# Altium schematic sheet SD_SC.SchDoc
size A4
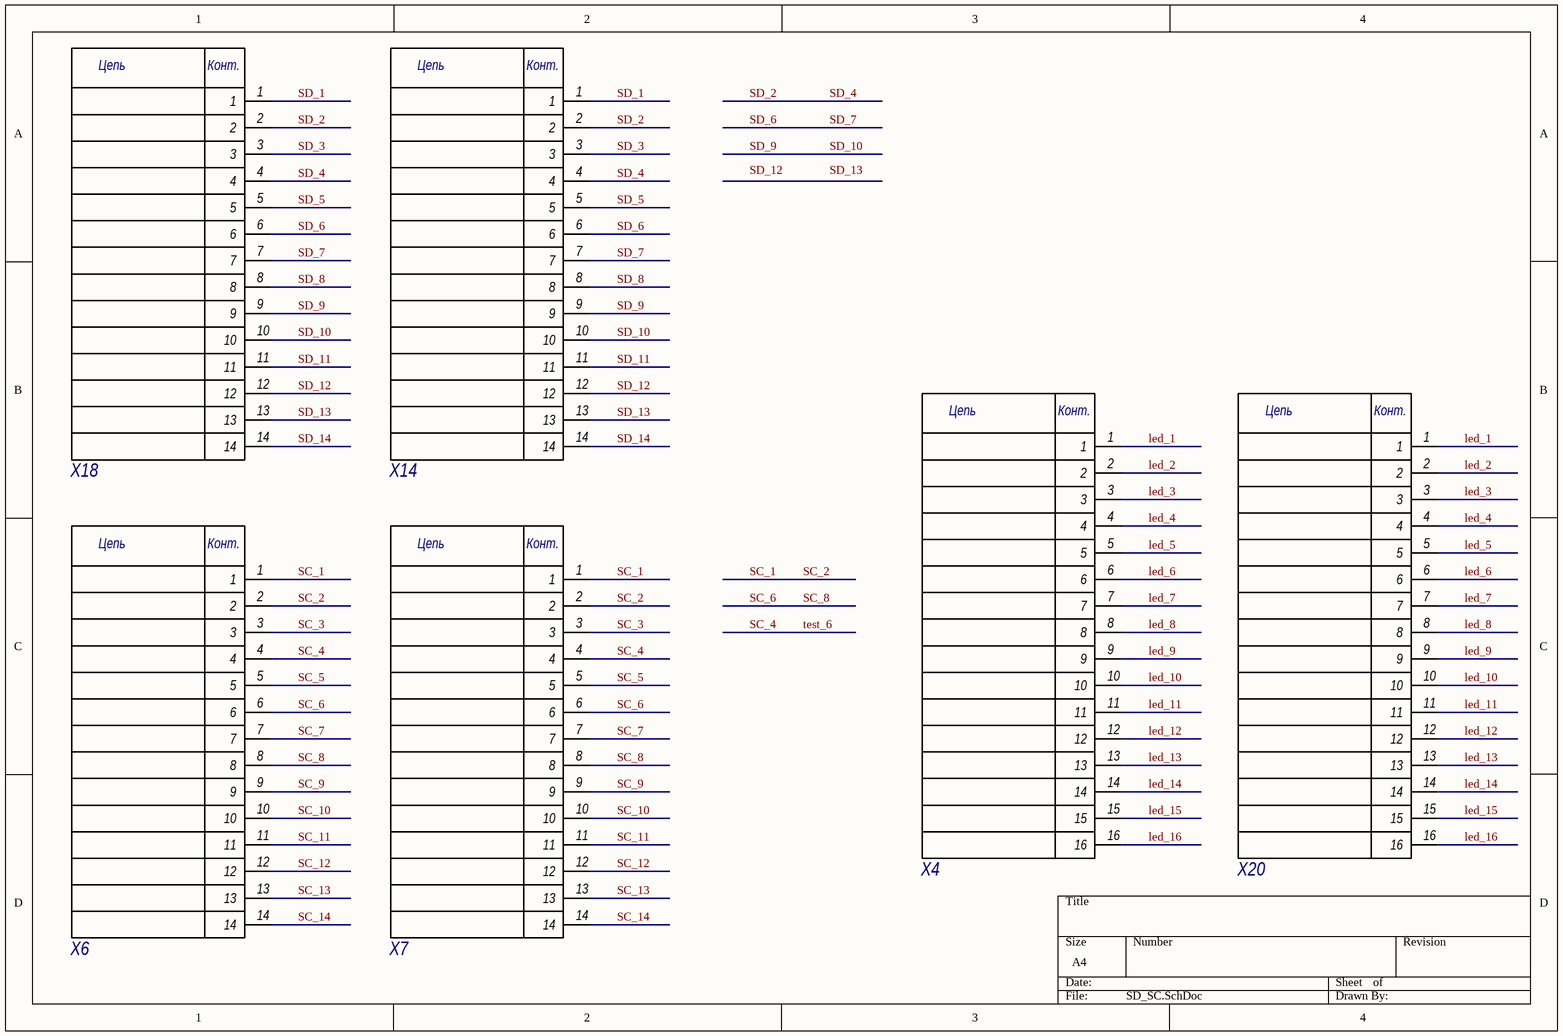
[diagram p0: SD_SC.SchDoc]

## Parts
X4  PLD-16  [PLD-16]  (value not drawn)
X6  2x7  [87832_1420]  (value not drawn)
X7  PLD-14  [PLD-14]  (value not drawn)
X14  PLD-14  [PLD-14]  (value not drawn)
X18  2x7  [87832_1420]  (value not drawn)
X20  2x7  [87832_1620]  (value not drawn)

## Nets
led_1: X4.1 X20.1
led_2: X4.2 X20.2
led_3: X4.3 X20.3
led_4: X4.4 X20.4
led_5: X4.5 X20.5
led_6: X4.6 X20.6
led_7: X4.7 X20.7
led_8: X4.8 X20.8
led_9: X4.9 X20.9
led_10: X4.10 X20.10
led_11: X4.11 X20.11
led_12: X4.12 X20.12
led_13: X4.13 X20.13
led_14: X4.14 X20.14
led_15: X4.15 X20.15
led_16: X4.16 X20.16
SC_1: X6.1 X6.2 X7.1 X7.2  [also labelled SC_2]
SC_3: X6.3 X7.3
SC_4: X6.4 X7.4  [also labelled test_6]
SC_5: X6.5 X7.5
SC_6: X6.6 X6.8 X7.6 X7.8  [also labelled SC_8]
SC_7: X6.7 X7.7
SC_9: X6.9 X7.9
SC_10: X6.10 X7.10
SC_11: X6.11 X7.11
SC_12: X6.12 X7.12
SC_13: X6.13 X7.13
SC_14: X6.14 X7.14
SD_1: X14.1 X18.1
SD_2: X14.2 X14.4 X18.2 X18.4  [also labelled SD_4]
SD_3: X14.3 X18.3
SD_5: X14.5 X18.5
SD_6: X14.6 X14.7 X18.6 X18.7  [also labelled SD_7]
SD_8: X14.8 X18.8
SD_10: X14.9 X14.10 X18.9 X18.10  [also labelled SD_9]
SD_11: X14.11 X18.11
SD_12: X14.12 X18.12
SD_13: X14.13 X18.13
SD_14: X14.14 X18.14

## Notes on the sheet
- Labels drawn without touching a wire or pin: SD_12, SD_13
- (in symbol 87832-1420) Цепь; Конт.
- (in symbol 87832-1620) Цепь; Конт.
- (in symbol PLD-14) Цепь; Конт.
- (in symbol PLD-16) Цепь; Конт.

## Library data of the parts
X4 = PLD-16: штыри на плату; PartNumberFrom1C: Штырь PLD-16; Код: 191; 1CType: Штырь; Number of Positions: 16; System: Connector; PartNumber: PLD-16; PartNumberFrom1C_accuracy: Штырь PLD-16; OrderCode: PLD-16; Mounting Type: Through Hole; Termination: Solder; ComponentLink: https://www.chipdip.ru/product/pld-16; ComponentLink1URL: https://www.chipdip.ru/product/pld-16; ComponentLink1Description: Технические характеристики
X6 X18 = 87832-1420: Connector Header Surface Mount 14 position 0.079" (2.00mm); PartNumberFrom1C: Вилка Molex 87832-1420; Manufacturer: Molex; Код: 180; 1CType: Вилка; Extended Price: $8,807.50/10000; Number of Positions: 14; Number of Positions Loaded: All; PartNumber: 87832-1420; PartNumberFrom1C_accuracy: Вилка Molex 87832-1420; OrderCode: 87832-1420; Unit Price: $1.83; Packaging: Tube; Series: Milli-Grid 87832; Contact Type: Male Pin; Pitch - Mating: 0.079" (2.00mm); Number of Rows: 2; Row Spacing: 0.079" (2.00mm); Mounting Type: Surface Mount; Fastening Type: Latch Holder; Termination: Solder; Contact Finish Thickness: 15.0µin (0.38µm); ComponentLink: https://www.digikey.com/product-detail/en/molex/0878321416/WM8613-ND/3044734; ComponentLink1URL: https://www.digikey.com/product-detail/en/molex/0878321416/WM8613-ND/3044734; ComponentLink1Description: Технические характеристики; System: Connector
X7 X14 = PLD-14: штыри на плату; PartNumberFrom1C: Штырь PLD-14; Код: 318; 1CType: Штырь; Minimum Quantity: 1; Number of Positions: 14; Pitch - Mating: 2,54 мм; System: Connector; PartNumber: PLD-14; PartNumberFrom1C_accuracy: Штырь PLD-14; OrderCode: PLD-14; Mounting Type: Through Hole; Termination: Solder; ComponentLink: https://www.chipdip.ru/product/pld-16; ComponentLink1URL: https://www.chipdip.ru/product/pld-16; ComponentLink1Description: Технические характеристики
X20 = 87832-1620: Connector Header Surface Mount 16 position 0.079" (2.00mm); PartNumberFrom1C: Вилка Molex 87832-1620; Manufacturer: Molex; Код: 264; 1CType: Вилка; Extended Price: $9,662.90/10000; Minimum Quantity: 1; Number of Positions: 16; Number of Positions Loaded: All; PartNumber: 87832-1620; PartNumberFrom1C_accuracy: Вилка Molex 87832-1620; OrderCode: 87832-1620; Unit Price: $2.01; Packaging: Tube; Series: Milli-Grid 87832; Contact Type: Male Pin; Pitch - Mating: 0.079" (2.00mm); Number of Rows: 2; Row Spacing: 0.079" (2.00mm); Mounting Type: Surface Mount; Fastening Type: Latch Holder; Termination: Solder; Contact Finish Thickness: 15.0µin (0.38µm); ComponentLink: https://www.digikey.com/products/en?keywords=87832-1620; ComponentLink1URL: https://www.digikey.com/products/en?keywords=87832-1620; ComponentLink1Description: Технические характеристики; System: Connector